# EAGLE design SCH1001-001-006-320 - Program Flash (EAGLE 9.4.2)
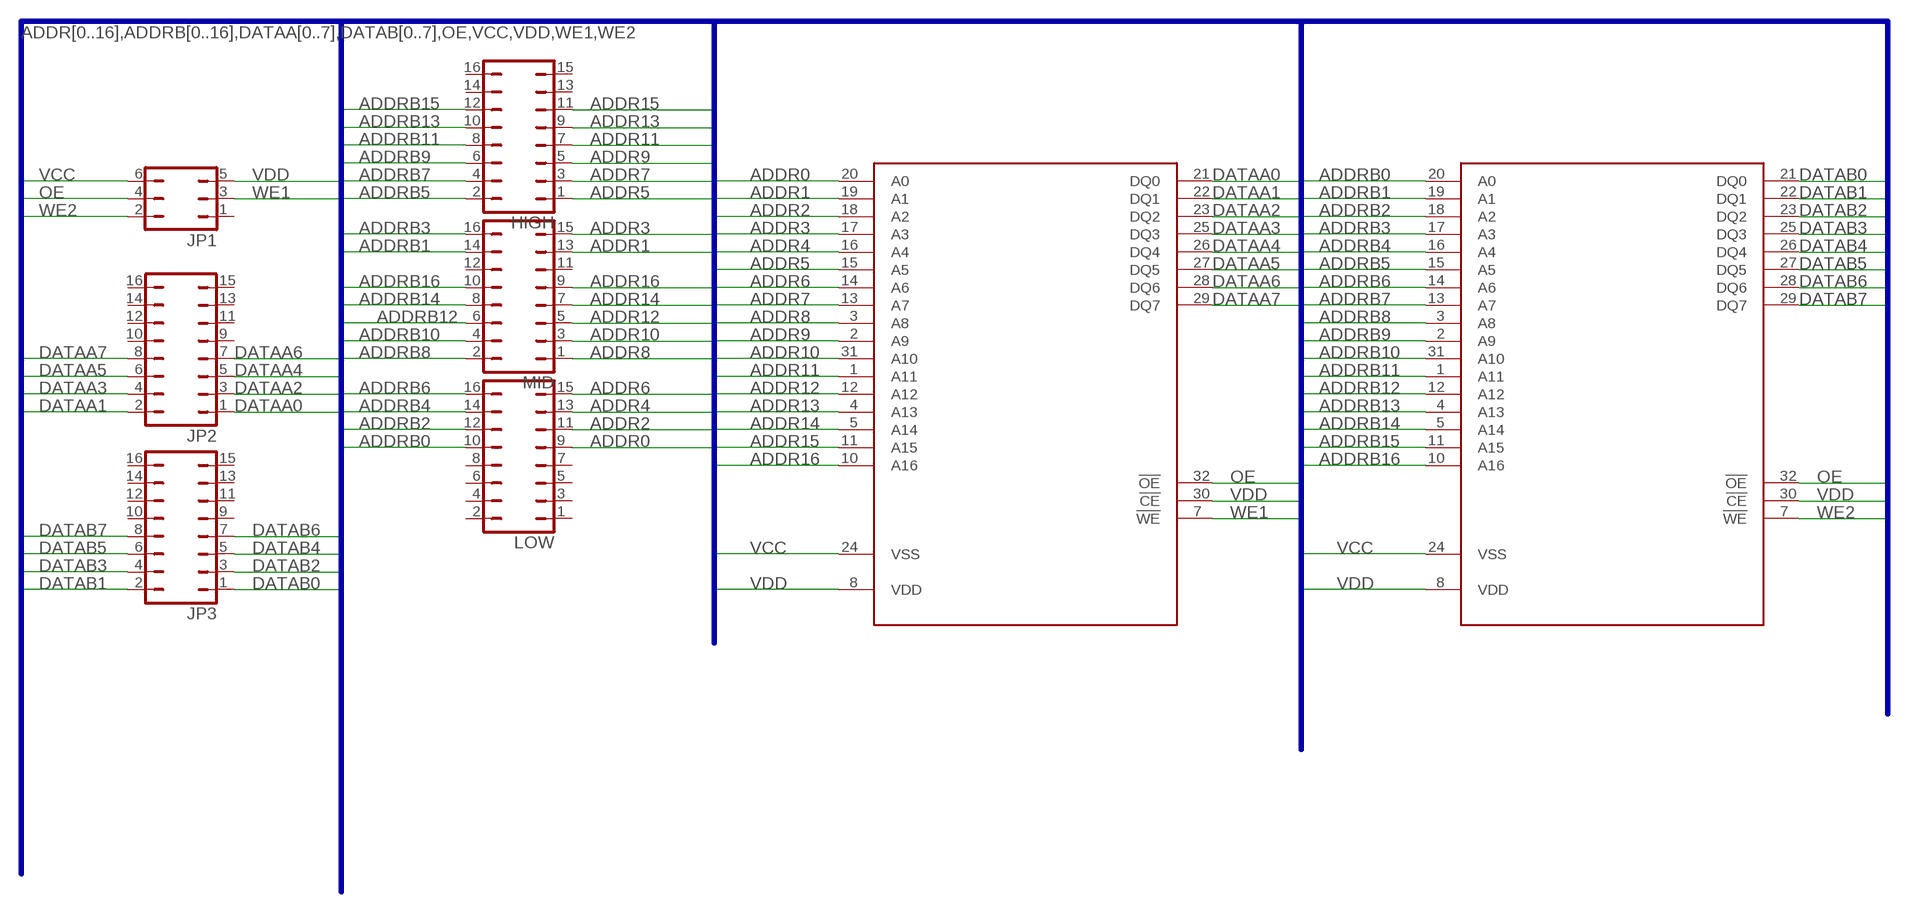
[diagram p0: schematic, sheet 1]

## Parts
HIGH  JP8Q  [JP8Q]
JP1  JP3Q  [JP3Q]
JP2  JP8Q  [JP8Q]
JP3  JP8Q  [JP8Q]
LOW  JP8Q  [JP8Q]
MID  JP8Q  [JP8Q]
U$1  PROGRAMFLASH  [TSOP32]
U$2  PROGRAMFLASH  [TSOP32]

## Nets
ADDR0: LOW.9 U$1.20(A0)
ADDR1: MID.13 U$1.19(A1)
ADDR2: LOW.11 U$1.18(A2)
ADDR3: MID.15 U$1.17(A3)
ADDR4: LOW.13 U$1.16(A4)
ADDR5: HIGH.1 U$1.15(A5)
ADDR6: LOW.15 U$1.14(A6)
ADDR7: HIGH.3 U$1.13(A7)
ADDR8: MID.1 U$1.3(A8)
ADDR9: HIGH.5 U$1.2(A9)
ADDR10: MID.3 U$1.31(A10)
ADDR11: HIGH.7 U$1.1(A11)
ADDR12: MID.5 U$1.12(A12)
ADDR13: HIGH.9 U$1.4(A13)
ADDR14: MID.7 U$1.5(A14)
ADDR15: HIGH.11 U$1.11(A15)
ADDR16: MID.9 U$1.10(A16)
ADDRB0: LOW.10 U$2.20(A0)
ADDRB1: MID.14 U$2.19(A1)
ADDRB2: LOW.12 U$2.18(A2)
ADDRB3: MID.16 U$2.17(A3)
ADDRB4: LOW.14 U$2.16(A4)
ADDRB5: HIGH.2 U$2.15(A5)
ADDRB6: LOW.16 U$2.14(A6)
ADDRB7: HIGH.4 U$2.13(A7)
ADDRB8: MID.2 U$2.3(A8)
ADDRB9: HIGH.6 U$2.2(A9)
ADDRB10: MID.4 U$2.31(A10)
ADDRB11: HIGH.8 U$2.1(A11)
ADDRB12: MID.6 U$2.12(A12)
ADDRB13: HIGH.10 U$2.4(A13)
ADDRB14: MID.8 U$2.5(A14)
ADDRB15: HIGH.12 U$2.11(A15)
ADDRB16: MID.10 U$2.10(A16)
DATAA0: JP2.1 U$1.21(DQ0)
DATAA1: JP2.2 U$1.22(DQ1)
DATAA2: JP2.3 U$1.23(DQ2)
DATAA3: JP2.4 U$1.25(DQ3)
DATAA4: JP2.5 U$1.26(DQ4)
DATAA5: JP2.6 U$1.27(DQ5)
DATAA6: JP2.7 U$1.28(DQ6)
DATAA7: JP2.8 U$1.29(DQ7)
DATAB0: JP3.1 U$2.21(DQ0)
DATAB1: JP3.2 U$2.22(DQ1)
DATAB2: JP3.3 U$2.23(DQ2)
DATAB3: JP3.4 U$2.25(DQ3)
DATAB4: JP3.5 U$2.26(DQ4)
DATAB5: JP3.6 U$2.27(DQ5)
DATAB6: JP3.7 U$2.28(DQ6)
DATAB7: JP3.8 U$2.29(DQ7)
OE: JP1.4 U$1.32(!OE) U$2.32(!OE)
VCC [power]: JP1.6 U$1.24(VSS) U$2.24(VSS)
VDD [power]: JP1.5 U$1.8(VDD) U$1.30(!CE) U$2.8(VDD) U$2.30(!CE)
WE1: JP1.3 U$1.7(!WE)
WE2: JP1.2 U$2.7(!WE)
Unconnected: HIGH.13 HIGH.14 HIGH.15 HIGH.16 JP1.1 JP2.9 JP2.10 JP2.11 JP2.12 JP2.13 JP2.14 JP2.15 JP2.16 JP3.9 JP3.10 JP3.11 JP3.12 JP3.13 JP3.14 JP3.15 JP3.16 LOW.1 LOW.2 LOW.3 LOW.4 LOW.5 LOW.6 LOW.7 LOW.8 MID.11 MID.12

## Buses
ADDR[0..16],ADDRB[0..16],DATAA[0..7],DATAB[0..7],OE,VCC,VDD,WE1,WE2

## Library data of the parts
HIGH JP2 JP3 LOW MID = jumper:JP8Q: JUMPER
JP1 = jumper:JP3Q: JUMPER
U$1 U$2 = 16bit:PROGRAMFLASH

## Net classes
1 power: width 0.254 mm

## Board
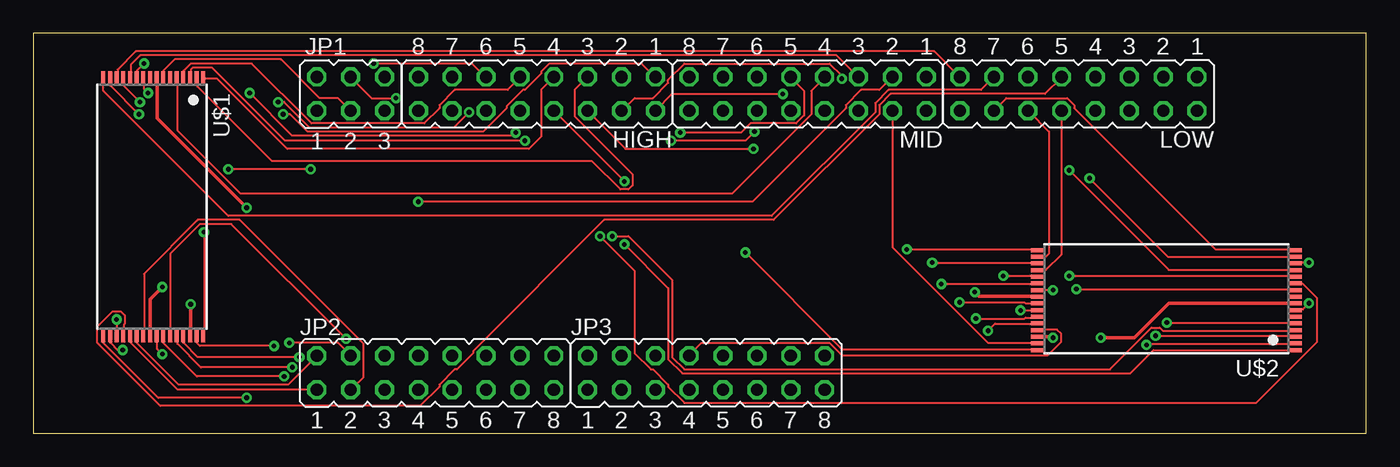
[diagram p1: board, top side]
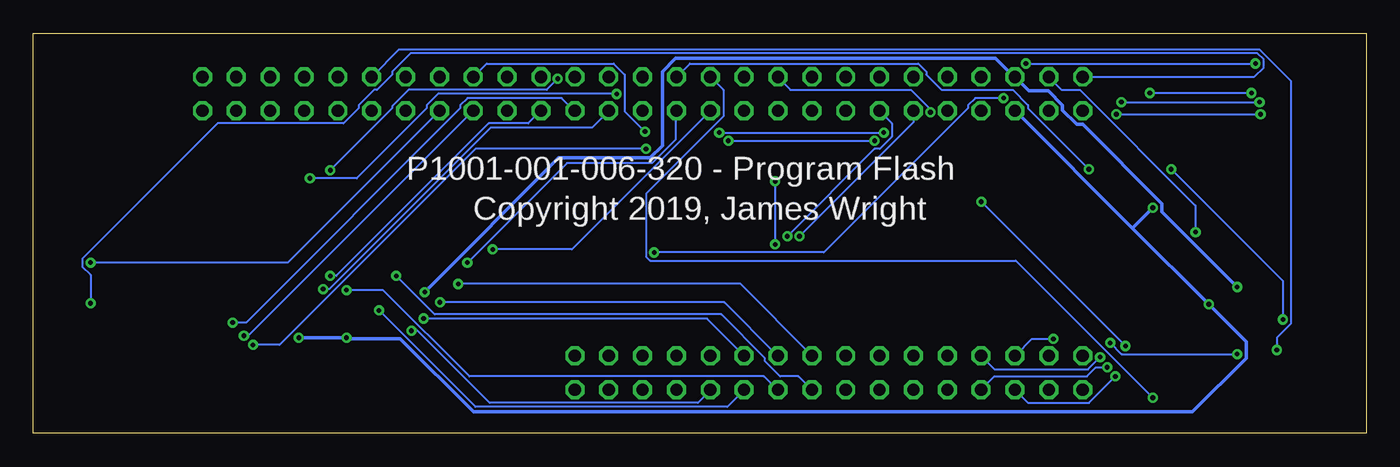
[diagram p2: board, bottom side, seen from below]

Size 100 x 30 mm. Coordinates in mm from the lower left corner, seen from the top.
Outline: 0,0 100,0 100,30 0,30 0,0
Copper layers (1*16): Top 0.035mm / dielectric 1.5mm / Bottom 0.035mm
Design rules "default": minimum track width 6mil, minimum drill 0.35mm, track to track 6mil, track to pad 6mil, pad to pad 6mil, via to via 6mil, smd to smd 6mil, copper to edge 40mil, drill to drill 6mil, minimum pad ring 10mil, minimum via ring 8mil, stop-mask expansion 4mil, vias tented up to drill 0mil, thermal gap 10mil

### Footprints (pad centres in the part's own frame; a part is rotated, then mirrored left to right if it is on the bottom)
JP8Q = drill 0.914 octagon: 1 -8.89,-1.27; 2 -8.89,1.27; 3 -6.35,-1.27; 4 -6.35,1.27; 5 -3.81,-1.27; 6 -3.81,1.27; 7 -1.27,-1.27; 8 -1.27,1.27; 9 1.27,-1.27; 10 1.27,1.27; 11 3.81,-1.27; 12 3.81,1.27; 13 6.35,-1.27; 14 6.35,1.27; 15 8.89,-1.27; 16 8.89,1.27
JP3Q = drill 0.914 octagon: 1 -2.54,-1.27; 2 -2.54,1.27; 3 0,-1.27; 4 0,1.27; 5 2.54,-1.27; 6 2.54,1.27
TSOP32 = smd 1.1 x 0.3: 1 -9.625,5.75; 2 -9.625,5.25; 3 -9.625,4.75; 4 -9.625,4.25; 5 -9.625,3.75; 6 -9.625,3.25; 7 -9.625,2.75; 8 -9.625,2.25; 9 -9.625,1.75; 10 -9.625,1.25; 11 -9.625,0.75; 12 -9.625,0.25; 13 -9.625,-0.25; 14 -9.625,-0.75; 15 -9.625,-1.25; 16 -9.625,-1.75; 17 9.625,-1.75; 18 9.625,-1.25; 19 9.625,-0.75; 20 9.625,-0.25; 21 9.625,0.25; 22 9.625,0.75; 23 9.625,1.25; 24 9.625,1.75; 25 9.625,2.25; 26 9.625,2.75; 27 9.625,3.25; 28 9.625,3.75; 29 9.625,4.25; 30 9.625,4.75; 31 9.625,5.25; 32 9.625,5.75

### Placement (x,y rotation side)
HIGH  37.78,25.46 180 top
JP1  23.81,25.46 0 top
JP2  30.16,4.54 0 top
JP3  50.48,4.54 0 top
LOW  78.42,25.46 180 top
MID  58.1,25.46 180 top
U$1  7,17 270 top
U$2  85,12 180 top

### Tracks (layer width: path | path; a pad name or v marks a point on that pad's centre or on a via)
ADDR0
  Top 0.152: U$1.20 6.78,7.39 6.78,8.15 6.86,8.23 6.86,8.84 6.55,9.14 5.94,9.14 4.8,8 4.8,6.78 9.53,2.06 29.03,2.06 30.48,3.5 30.48,3.66 31.62,4.8 31.77,4.8 32.99,6.02 32.99,6.17 42.82,16 55.55,16 63.48,23.93 63.48,24.61 64.31,25.45 75.89,25.45 77.11,26.67 LOW.9
ADDR1  (via drill 0.35)
  Top 0.152: v6.25,8.53 U$1.19 | v20.8,19.81 v14.63,19.81
  Bottom 0.152: v6.25,8.53 6.25,11.43 v14.63,19.81 | v20.8,19.81 25.38,24.38 25.38,24.61 26.52,25.76 31.85,25.76 32.99,26.9 32.99,27.13 33.6,27.74 50.75,27.74 51.74,26.75 MID.13
ADDR2  (via drill 0.35)
  Top 0.152: v6.71,6.25 6.33,6.25 5.79,6.78 5.79,7.32 U$1.18
  Bottom 0.152: v6.71,6.25 6.71,7.16 5.64,8.23 5.64,26.44 8,28.8 72.54,28.8 74.6,26.75 LOW.11
ADDR3  (via drill 0.35)
  Top 0.152: v16,2.67 9.37,2.67 5.26,6.78 5.26,7.32 U$1.17
  Bottom 0.152: v16,2.67 26.29,12.95 53.72,12.95 54.03,13.26 54.03,17.98 48.23,23.77 48.23,25.76 49.15,26.67 MID.15
ADDR4
  Top 0.152: U$1.16 5.26,26.59 5.26,25.68 14.63,16.31 55.4,16.31 63.17,24.08 63.17,24.77 64.16,25.76 71.09,25.76 72.01,26.67 LOW.13
ADDR5  (via drill 0.35)
  Top 0.152: v7.92,23.93 5.79,26.06 5.79,26.59 U$1.15 | v18.75,23.93 19.28,23.93 20.57,22.63 33.76,22.63 35.51,24.38 35.51,24.54 36.73,25.76 36.88,25.76 38.1,26.98 38.1,27.13 38.71,27.74 45.64,27.74 46.63,26.75 HIGH.1
  Bottom 0.152: v18.75,23.93 v7.92,23.93
ADDR6
  Top 0.152: U$1.14 6.33,26.67 6.33,27.28 7.7,28.65 67.59,28.65 69.49,26.75 LOW.15
ADDR7  (via drill 0.35)
  Top 0.152: v8,24.84 6.78,26.06 6.78,26.59 U$1.13 | v18.36,24.84 18.82,24.84 20.73,22.94 31.55,22.94 v32.69,24.08
  Bottom 0.152: v18.36,24.84 v8,24.84 | v32.69,24.08 32.69,24.31 34.14,25.76 43.2,25.76 44.12,26.67 HIGH.3
ADDR8  (via drill 0.35)
  Top 0.152: v36.88,21.95 18.9,21.95 13.41,27.43 11.96,27.43 11.81,27.28 11.81,26.67 U$1.3 | v47.85,21.95 53.42,21.95 v54.1,22.63
  Bottom 0.152: v47.85,21.95 v36.88,21.95 | v54.1,22.63 55.63,24.16 55.63,26.9 56.46,27.74 65.99,27.74 66.98,26.75 MID.1
ADDR9
  Top 0.152: U$1.2 12.27,26.59 12.27,26.06 17.91,20.42 41.91,20.42 44.04,18.29 44.65,18.29 44.96,18.59 44.96,19.43 40.62,23.77 40.62,25.76 41.53,26.67 HIGH.5
ADDR10  (via drill 0.35)
  Top 0.152: v18.06,6.55 12.5,6.55 12.27,6.78 12.27,7.32 U$1.31 | v28.88,17.37 53.95,17.37 60.96,24.38 60.96,24.61 62.1,25.76 63.48,25.76 64.39,26.67 MID.3
  Bottom 0.152: v28.88,17.37 v18.06,6.55
ADDR11
  Top 0.152: U$1.1 12.8,26.59 13.79,26.59 19.05,21.34 37.19,21.34 38.1,22.25 38.1,25.76 39.01,26.67 HIGH.7
ADDR12
  Top 0.152: U$1.12 7.32,26.67 7.32,27.66 8,28.35 60.27,28.35 61.87,26.75 MID.5
ADDR13
  Top 0.152: U$1.4 11.28,26.67 11.28,27.2 11.81,27.74 16.38,27.74 20.88,23.24 29.34,23.24 30.48,24.38 30.48,24.61 31.62,25.76 35.59,25.76 36.5,26.67 HIGH.9
ADDR14
  Top 0.152: U$1.5 10.82,26.59 10.82,22.71 15.54,17.98 52.43,17.98 58.37,23.93 58.37,25.68 59.36,26.67 MID.7
ADDR15  (via drill 0.35)
  Top 0.152: v8.31,27.74 7.77,27.2 7.77,26.67 U$1.11 | v25.53,27.74 32.92,27.74 33.91,26.75 HIGH.11
  Bottom 0.152: v25.53,27.74 v8.31,27.74
ADDR16  (via drill 0.35)
  Top 0.152: v8.61,25.53 8.31,25.83 8.31,26.59 U$1.10 | v16.23,25.53 19.43,22.33 35.97,22.33 v36.2,22.55 | v48.54,22.55 53.11,22.55 53.8,23.24 57.23,23.24 57.84,23.85 57.84,25.68 56.84,26.67 MID.9
  Bottom 0.152: v16.23,25.53 v8.61,25.53 | v48.54,22.55 v36.2,22.55
ADDRB0
  Top 0.152: U$2.20 75.44,12.27 75.97,12.27 77.11,13.41 77.11,24.16 LOW.10
ADDRB1  (via drill 0.35)
  Top 0.152: v67.44,12.8 75.36,12.8 U$2.19
  Bottom 0.152: v67.44,12.8 59.97,20.27 53.57,20.27 51.82,22.02 51.82,24.16 MID.14
ADDRB2
  Top 0.152: U$2.18 75.44,13.26 75.97,13.26 76.2,13.49 76.2,22.63 74.68,24.16 LOW.12
ADDRB3  (via drill 0.35)
  Top 0.152: v65.53,13.79 75.36,13.79 U$2.17
  Bottom 0.152: v65.53,13.79 59.59,13.79 49.23,24.16 MID.16
ADDRB4
  Top 0.152: U$2.16 94.56,13.79 88.7,13.79 78.11,24.38 78.11,24.61 77.57,25.15 73,25.15 72.08,24.23 LOW.14
ADDRB5  (via drill 0.35)
  Top 0.152: v79.25,19.13 85.11,13.26 94.56,13.26 U$2.15 | v56.24,25.45 47.93,25.45 46.71,24.23 HIGH.2
  Bottom 0.152: v79.25,19.13 75.74,19.13 70.48,24.38 70.48,24.61 69.65,25.45 v56.24,25.45
ADDRB6  (via drill 0.35)
  Top 0.152: v95.71,12.8 94.64,12.8 U$2.14
  Bottom 0.152: v95.71,12.8 80.92,12.8 69.57,24.16 LOW.16
ADDRB7  (via drill 0.35)
  Top 0.152: v77.72,19.74 85.19,12.27 94.56,12.27 U$2.13 | v60.66,26.59 60.66,26.82 59.74,27.74 48.84,27.74 47.62,26.52 47.62,26.29 46.48,25.15 45.11,25.15 44.2,24.23 HIGH.4
  Bottom 0.152: v77.72,19.74 73.08,24.38 73.08,24.54 71.86,25.76 61.49,25.76 v60.66,26.59
ADDRB8  (via drill 0.35)
  Top 0.152: v84.2,7.32 94.56,7.32 U$2.3
  Bottom 0.152: v84.2,7.32 83.9,7.32 67.06,24.16 MID.2
ADDRB9  (via drill 0.35)
  Top 0.152: v83.52,6.63 83.59,6.71 94.56,6.71 U$2.2 | v54.03,21.34 44.42,21.34 41.6,24.16 HIGH.6
  Bottom 0.152: v83.52,6.63 81.53,6.63 66.83,21.34 v54.03,21.34
ADDRB10
  Top 0.152: U$2.31 75.36,6.78 71.63,6.78 64.47,13.95 64.47,24.16 MID.4
ADDRB11  (via drill 0.35)
  Top 0.152: v44.35,14.17 47.62,10.9 47.62,5.56 48.69,4.5 82.3,4.5 84.05,6.25 94.56,6.25 U$2.1 | v44.35,18.9 39.09,24.16 HIGH.8
  Bottom 0.152: v44.35,18.9 v44.35,14.17
ADDRB12  (via drill 0.35)
  Top 0.152: v77.72,11.81 94.56,11.81 U$2.12
  Bottom 0.152: v77.72,11.81 77.27,11.81 65.84,23.24 62.87,23.24 61.95,24.16 MID.6
ADDRB13  (via drill 0.35)
  Top 0.152: v43.43,14.78 44.65,14.78 47.93,11.51 47.93,5.71 48.84,4.8 80.77,4.8 83.9,7.92 84.51,7.92 84.73,7.7 94.56,7.7 U$2.4
  Bottom 0.152: v43.43,14.78 36.88,21.34 36.5,21.34 35.59,22.25 35.59,23.24 36.5,24.16 HIGH.10
ADDRB14  (via drill 0.35)
  Top 0.152: v85.04,8.31 94.56,8.31 U$2.5
  Bottom 0.152: v85.04,8.31 84.05,8.31 67.97,24.38 67.97,24.61 67.44,25.15 60.35,25.15 59.44,24.23 MID.8
ADDRB15  (via drill 0.35)
  Top 0.152: v42.52,14.78 45.11,12.19 45.11,6.02 46.33,4.8 46.48,4.8 47.62,3.66 47.62,3.5 48.84,2.29 91.75,2.29 96.32,6.86 96.32,10.13 95.25,11.2 94.64,11.2 U$2.11
  Bottom 0.152: v42.52,14.78 33.98,23.32 33.98,24.16 HIGH.12
ADDRB16  (via drill 0.35)
  Top 0.152: v78.26,10.82 94.56,10.82 U$2.10
  Bottom 0.152: v78.26,10.82 77.8,10.82 65.68,22.94 58.06,22.94 56.84,24.16 MID.10
DATAA0
  Top 0.152: U$1.21 7.32,7.32 7.32,6.78 10.82,3.28 JP2.1
DATAA1
  Top 0.152: U$1.22 7.77,7.32 7.77,6.78 10.9,3.66 19.13,3.66 21.26,5.79 JP2.2
DATAA2
  Top 0.152: U$1.23 8.31,7.39 8.31,11.96 12.34,16 15.47,16 24.77,6.71 24.77,4.19 23.85,3.28 JP2.3
DATAA3  (via drill 0.35)
  Top 0.152: v9.68,5.94 9.3,6.33 9.3,7.32 U$1.25 | v19.2,6.78 22.86,6.78 23.77,5.87 JP2.4
  Bottom 0.152: v9.68,5.94 18.36,5.94 v19.2,6.78
DATAA4  (via drill 0.35)
  Top 0.152: v18.82,4.27 12.27,4.27 9.75,6.78 9.75,7.32 U$1.26
  Bottom 0.152: v18.82,4.27 20.8,2.29 25.38,2.29 26.29,3.2 JP2.5
DATAA5  (via drill 0.35)
  Top 0.152: v23.47,7.09 14.86,15.7 12.5,15.7 10.29,13.49 10.29,7.39 U$1.27
  Bottom 0.152: v23.47,7.09 25.07,7.09 26.29,5.87 JP2.6
DATAA6  (via drill 0.35)
  Top 0.152: v19.43,4.95 12.57,4.95 10.82,6.71 10.82,7.32 U$1.28
  Bottom 0.152: v19.43,4.95 20.27,4.95 20.95,4.27 27.89,4.27 JP2.7
DATAA7  (via drill 0.35)
  Top 0.152: v19.96,5.71 12.34,5.71 11.28,6.78 11.28,7.32 U$1.29
  Bottom 0.152: v19.96,5.71 20.88,4.8 27.89,4.8 28.88,5.79 JP2.8
DATAB0  (via drill 0.35)
  Top 0.152: v72.77,11.81 75.36,11.81 U$2.21
  Bottom 0.152: v72.77,11.81 69.88,8.91 48.39,8.91 45.11,5.64 45.11,5.41 43.97,4.27 42.6,4.27 41.6,3.28 JP3.1
DATAB1  (via drill 0.35)
  Top 0.152: v68.12,11.2 75.36,11.2 U$2.22
  Bottom 0.152: v68.12,11.2 46.94,11.2 41.6,5.87 JP3.2
DATAB2  (via drill 0.35)
  Top 0.152: v76.5,10.74 75.44,10.74 U$2.23
  Bottom 0.152: v76.5,10.74 73.76,10.74 67.28,4.27 45.19,4.27 44.2,3.28 JP3.3
DATAB3  (via drill 0.35)
  Top 0.152: v69.49,9.83 74.37,9.83 74.45,9.75 75.36,9.75 U$2.25
  Bottom 0.152: v69.49,9.83 48.16,9.83 44.2,5.87 JP3.4
DATAB4  (via drill 0.35)
  Top 0.152: v74.07,9.22 75.36,9.22 U$2.26
  Bottom 0.152: v74.07,9.22 66.83,1.98 47.93,1.98 46.71,3.2 JP3.5
DATAB5  (via drill 0.35)
  Top 0.152: v70.71,8.61 74.37,8.61 74.45,8.69 75.36,8.69 U$2.27
  Bottom 0.152: v70.71,8.61 49.45,8.61 46.71,5.87 JP3.6
DATAB6  (via drill 0.35)
  Top 0.152: v71.63,7.7 72.16,8.23 75.36,8.23 U$2.28
  Bottom 0.152: v71.63,7.7 71.17,7.7 65.76,2.29 50.14,2.29 49.23,3.2 JP3.7
DATAB7
  Top 0.152: U$2.29 75.44,7.77 76.81,7.77 77.11,7.47 77.11,6.86 76.12,5.87 60.66,5.87 59.74,6.78 50.14,6.78 49.23,5.87 JP3.8
OE  (via drill 0.35)
  Top 0.152: v12.8,15.09 12.8,7.39 U$1.32 | v53.42,13.56 60.66,6.33 75.36,6.33 U$2.32 | v27.2,25.15 25.38,25.15 23.85,26.67 JP1.4
  Bottom 0.152: v12.8,15.09 12.8,17.07 21.49,25.76 22.86,25.76 23.77,26.67 JP1.4 | v53.42,13.56 40.69,13.56 29.87,24.38 29.87,24.61 29.34,25.15 v27.2,25.15
VCC  (via drill 0.35)
  Top 0.254: v9.68,10.97 8.76,10.06 8.76,7.39 U$1.24 | v70.64,10.59 70.94,10.29 75.36,10.29 U$2.24
  Bottom 0.254: v9.68,10.97 15.32,16.61 15.32,17.22 21.26,23.16 21.72,23.16 22.78,24.23 22.78,24.61 23.85,25.68 25.3,25.68 26.29,26.67 JP1.6 26.44,26.75 27.81,28.12 51.82,28.12 52.81,27.13 52.81,21.57 53.72,20.65 60.58,20.65 v70.64,10.59
VDD  (via drill 0.35)
  Top 0.254: v76.5,7.16 76.43,7.24 75.44,7.24 U$2.30 | v80.09,7.16 82.6,7.16 85.19,9.75 94.56,9.75 U$2.8 | v11.81,9.68 11.81,7.39 U$1.30 | v16,16.92 9.3,23.62 9.3,26.59 U$1.8
  Bottom 0.254: v80.09,7.16 v76.5,7.16 76.43,7.09 72.47,7.09 66.98,1.6 13.03,1.6 8.99,5.64 8.99,6.86 v11.81,9.68 17.53,15.39 | 17.53,15.39 26.29,24.16 JP1.5 | 17.53,15.39 v16,16.92
WE1
  Top 0.152: U$1.7 9.75,26.67 9.75,27.2 10.59,28.04 18.59,28.04 21.49,25.15 22.86,25.15 23.77,24.23 JP1.3
WE2  (via drill 0.35)
  Top 0.152: v95.71,9.75 95.25,9.3 94.64,9.3 U$2.7
  Bottom 0.152: v95.71,9.75 95.71,11.89 96.32,12.5 96.32,13.11 86.18,23.24 76.73,23.24 75.59,24.38 75.59,24.61 74.45,25.76 74.22,25.76 73.08,26.9 73.08,27.13 71.7,28.5 8.15,28.5 7.7,28.04 7.7,27.43 8.38,26.75 21.26,26.75 JP1.2

### Text on the board
bNames: P1001-001-006-320 - Program Flash | Copyright 2019, James Wright